# Altium schematic sheet I2CInterface.SchDoc: I2C Interface
size Letter; Organization: Midnight Sun Solar Rayce Car Team; Address1: University of Waterloo; Address2: 200 University Ave W; Address3: Waterloo, ON, Canada; Address4: N2L 3E9; SheetNumber: 4; SheetTotal: 4; Website: www.uwmidsun.com
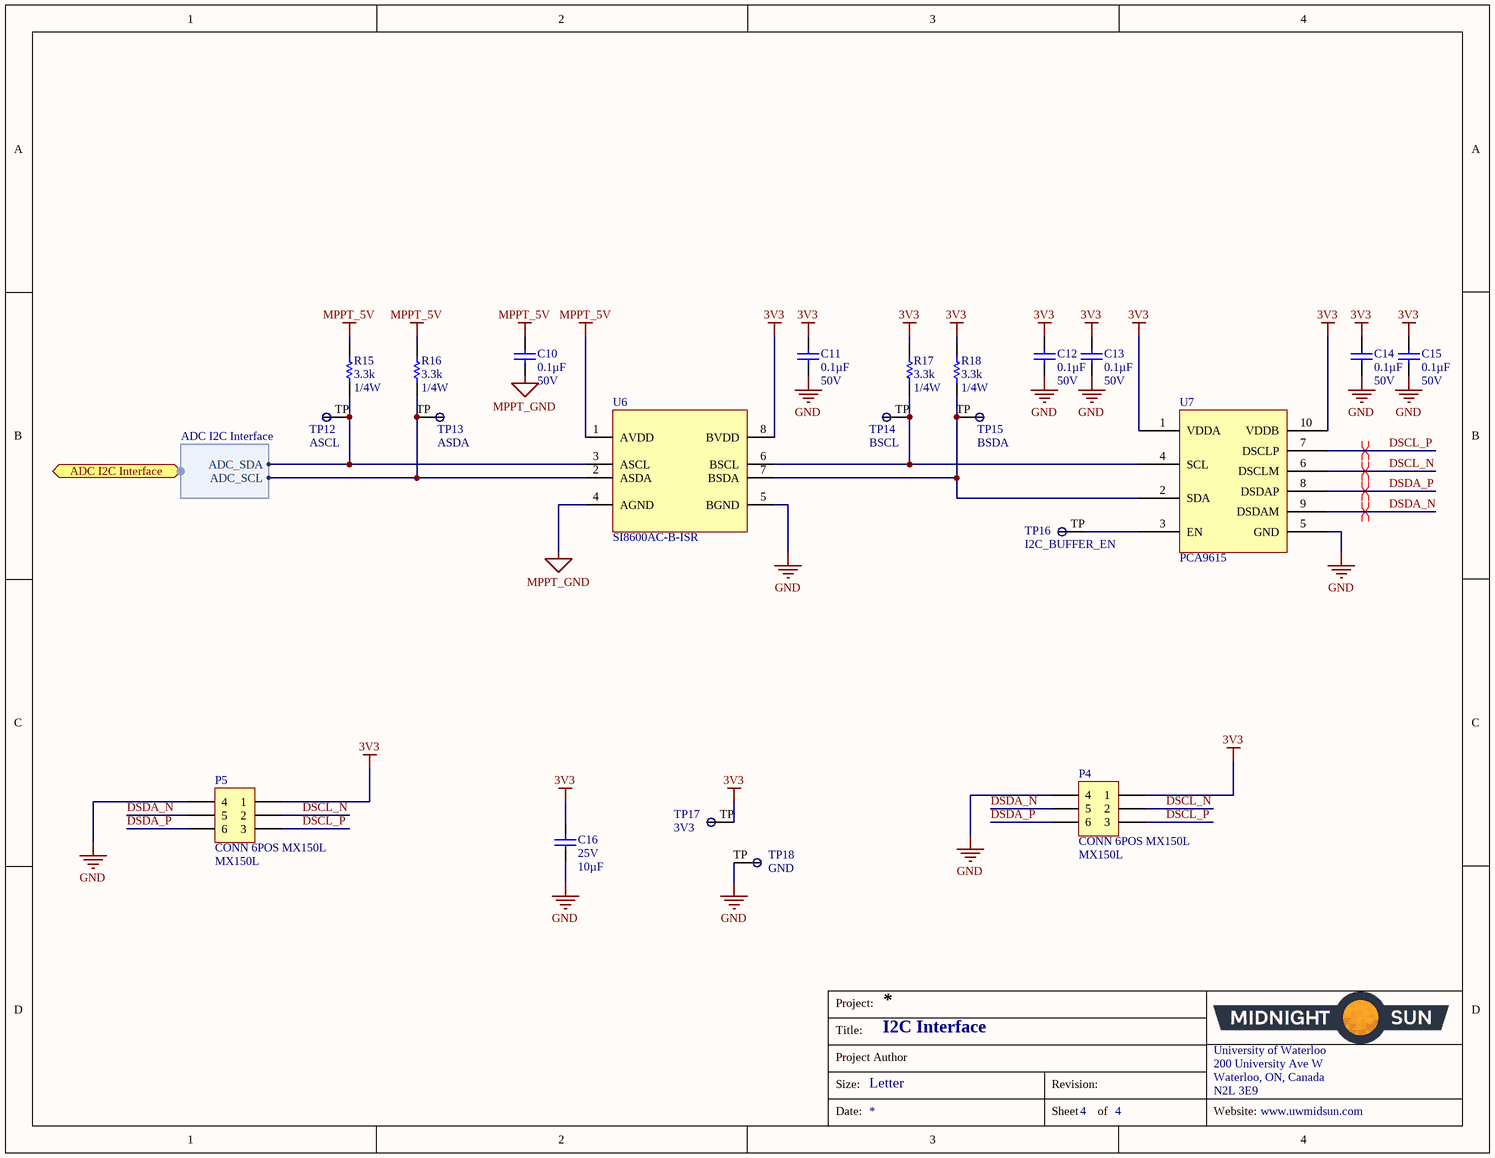
[diagram p0: I2CInterface.SchDoc]

## Parts
C10  Capacitance: 0.1µF  Voltage: 50V  [CAP, 0603]  (hidden comment: CAP CER 0.1UF 50V 10% X7R 0603)
C11  Capacitance: 0.1µF  Voltage: 50V  [CAP, 0603]  (hidden comment: CAP CER 0.1UF 50V 10% X7R 0603)
C12  Capacitance: 0.1µF  Voltage: 50V  [CAP, 0603]  (hidden comment: CAP CER 0.1UF 50V 10% X7R 0603)
C13  Capacitance: 0.1µF  Voltage: 50V  [CAP, 0603]  (hidden comment: CAP CER 0.1UF 50V 10% X7R 0603)
C14  Capacitance: 0.1µF  Voltage: 50V  [CAP, 0603]  (hidden comment: CAP CER 0.1UF 50V 10% X7R 0603)
C15  Capacitance: 0.1µF  Voltage: 50V  [CAP, 0603]  (hidden comment: CAP CER 0.1UF 50V 10% X7R 0603)
C16  Voltage - Rated: 25V  Capacitance: 10µF  [CAP, 0805]  (hidden comment: CAP CER 10uF 25V 10% X5R 0805)
P4  CONN 6POS MX150L  series: MX150L  [CONN, 6POS MX150L]
P5  CONN 6POS MX150L  series: MX150L  [CONN, 6POS MX150L]
R15  Resistance: 3.3k  Power: 1/4W  [RES, 0603]  (hidden comment: RES 3.3K OHM 1% 1/4W 0603)
R16  Resistance: 3.3k  Power: 1/4W  [RES, 0603]  (hidden comment: RES 3.3K OHM 1% 1/4W 0603)
R17  Resistance: 3.3k  Power: 1/4W  [RES, 0603]  (hidden comment: RES 3.3K OHM 1% 1/4W 0603)
R18  Resistance: 3.3k  Power: 1/4W  [RES, 0603]  (hidden comment: RES 3.3K OHM 1% 1/4W 0603)
TP12  ASCL  [Test Point]  (no BOM)
TP13  ASDA  [Test Point]  (no BOM)
TP14  BSCL  [Test Point]  (no BOM)
TP15  BSDA  [Test Point]  (no BOM)
TP16  I2C_BUFFER_EN  [Test Point]  (no BOM)
TP17  3V3  [Test Point]  (no BOM)
TP18  GND  [Test Point]  (no BOM)
U6  Manufacturer Part Number 1: SI8600AC-B-ISR  [IC DGTL ISO 3.75KV I2C 8SOIC NARROW BODY]  (hidden comment: IC DGTL ISO I2C 3.75KV 2CH 8SOIC)
U7  Base Part Number: PCA9615  [TSSOP50P490X110-10N]  (hidden comment: IC DIFFERENTIAL I2C BUFFER PCA9615)

## Ports
ADC I2C Interface (harness ADC I2C Interface)

## Harnesses
ADC I2C Interface: ADC_SCL, ADC_SDA

## Nets
3V3: C11.1 C12.1 C13.1 C14.1 C15.1 C16.1 P4.1 P5.1 R17.1 R18.1 TP17.TP U6.8(BVDD) U7.1(VDDA) U7.10(VDDB)
GND: C11.2 C12.2 C13.2 C14.2 C15.2 C16.2 P4.4 P5.4 TP18.TP U6.5(BGND) U7.5(GND)
MPPT_5V: C10.1 R15.1 R16.1 U6.1(AVDD)
MPPT_GND: C10.2 U6.4(AGND)
DSCL_N: P4.2 P5.2 U7.6(DSCLM)
DSCL_P: P4.3 P5.3 U7.7(DSCLP)
DSDA_N: P4.5 P5.5 U7.9(DSDAM)
DSDA_P: P4.6 P5.6 U7.8(DSDAP)
NetR15_2: R15.2 TP12.TP U6.3(ASCL) ; port ADC I2C Interface.ADC_SDA
NetR16_2: R16.2 TP13.TP U6.2(ASDA) ; port ADC I2C Interface.ADC_SCL
NetR17_2: R17.2 TP14.TP U6.6(BSCL) U7.4(SCL)
NetR18_2: R18.2 TP15.TP U6.7(BSDA) U7.2(SDA)
NetTP16_TP: TP16.TP U7.3(EN)

## Layout directives
differential pair: DSCL_N, DSCL_P, DSDA_N, DSDA_P

## Notes on the sheet
- Project:
- Title:
- Size:
- Project Author
- Letter
- Revision:
- University of Waterloo
- 200 University Ave W
- Waterloo, ON, Canada
- N2L 3E9
- Date:
- Sheet
- of
- Website:

## Library data of the parts
C10-C15 = CAP CER 0.1UF 50V 10% X7R 0603: 0.10µF ±10% 50V Ceramic Capacitor X7R 0603 (1608 Metric); Manufacturer 1: AVX Corporation; Manufacturer Part Number 1: 06035C104KAT2A; Supplier 1: Digi-Key; Supplier Part Number 1: 478-5052-1-ND; Packaging: Cut Tape (CT); Part Status: Active; Operating Temperature: -55°C ~ 125°C; Ratings: -; Mounting Type: Surface Mount, MLCC; Package / Case: 0603 (1608 Metric); Size / Dimension: 0.063" L x 0.032" W (1.60mm x 0.81mm); Height - Seated (Max): -; Thickness (Max): 0.035" (0.90mm); Lead Spacing: -; Lead Style: -; ComponentLink1URL: http://datasheets.avx.com/X7RDielectric.pdf; ComponentLink1Description: http://datasheets.avx.com/X7RDielectric.pdf; Tolerance: ±10%; Temperature Coefficient: X7R
C16 = CAP CER 10uF 25V 10% X5R 0805: 10µF ±10% 25V Ceramic Capacitor X5R 0805 (2012 Metric); Manufacturer: Murata Electronics North America; Manufacturer Part Number: GRM21BR61E106KA73L; Supplier 1: Digi-Key; RoHS: RoHS Compliant; Category: Capacitors; Stock 1: 1695157; Packaging: Cut Tape (CT); Part Status: Active; Tolerance: ±10%; Temperature Coefficient: X5R; Operating Temperature: -55°C ~ 85°C; Features: -; Ratings: -; Applications: General Purpose; Mounting Type: Surface Mount, MLCC; Package / Case: 0805 (2012 Metric); Size / Dimension: 0.079" L x 0.049" W (2.00mm x 1.25mm); Height - Seated (Max): -; Thickness (Max): 0.053" (1.35mm); Lead Spacing: -; Lead Style: -; ComponentLink1URL: http://search.murata.co.jp/Ceramy/image/img/A01X/G101/ENG/GRM21BR61E106KA73-01.pdf; ComponentLink1Description: http://search.murata.co.jp/Ceramy/image/img/A01X/G101/ENG/GRM21BR61E106KA73-01.pdf; Supplier Part Number 1: 490-5523-1-ND; Pricing 1: 1=0.3, 10=0.214, 100=0.1008, 500=0.07068, 1000=0.05851 (CAD)
P4 P5 = CONN 6POS MX150L: Connector Header Panel Mount, Through Hole, Right Angle 6 position 0.230" (5.84mm); Manufacturer: Molex; Manufacturer Part Number: 19427-0018; Number of Positions: 6; Connector Type: Male Pin; Current Rating: 18A; Gender: Male; Voltage Rating: 600V; Row Spacing: 0.23inch; Glow Wire Compliant: Non-compliant; Supplier 1: Digi-Key; Stock 1: 2808; Pricing 1: 1=6.02, 10=5.773, 100=4.769, 500=4.016, 1000=3.514 (USD); Mount: Through Hole,Panel; Housing Material: Polyester; Housing Colour: Black; Contact Plating: Nickel,Tin; Colour: Black; Contact Material: Copper Alloy; Min Operating Temperature: -40°C; Max Operating Temperature: 125°C; Number of Rows: 2; Packaging: Tray; Fastening Type: Ramp; Termination: Solder; Orientation: Right Angle; Package Quantity: 1; Number of Contacts: 6; Number of Circuits: 6; Pitch: 5.84mm; Radiation Hardening: No; Flammability Rating: UL94 V-0; ELV: Compliant; Lead Free: Lead Free; ComponentLink1URL: https://datasheet.ciiva.com/4554/0194270018-pcb-headers-135602-4554916.pdf; ComponentLink1Description: https://datasheet.ciiva.com/4554/0194270018-pcb-headers-135602-4554916.pdf; ComponentLink2URL: https://datasheet.ciiva.com/16725/0194270018-pcb-headers-16725700.pdf; ComponentLink2Description: https://datasheet.ciiva.com/16725/0194270018-pcb-headers-16725700.pdf; ComponentLink3URL: https://datasheet.ciiva.com/714/194270018-sd-714250.pdf; ComponentLink3Description: https://datasheet.ciiva.com/714/194270018-sd-714250.pdf; Supplier Part Number 1: WM17506-ND
R15-R18 = RES 3.3K OHM 1% 1/4W 0603: 3.3k Ohm ±1% 0.25W, 1/4W Chip Resistor 0603 (1608 Metric) Automotive AEC-Q200, Pulse Withstanding Thick Film; Manufacturer 1: Panasonic Electronic Components; Manufacturer Part Number 1: ERJ-PA3F3301V; Temperature Coefficient: ±100ppm/°C; Supplier 1: Digi-Key; Supplier Part Number 1: P3.3KBYCT-ND; Packaging: Cut Tape (CT); Part Status: Active; Composition: Thick Film; Operating Temperature: -55°C ~ 155°C; Package / Case: 0603 (1608 Metric); Supplier Device Package: 0603; Size / Dimension: 0.063" L x 0.031" W (1.60mm x 0.80mm); Height - Seated (Max): 0.022" (0.55mm); Failure Rate: -; ComponentLink1URL: https://industrial.panasonic.com/cdbs/www-data/pdf/RDO0000/AOA0000C291.pdf; ComponentLink1Description: https://industrial.panasonic.com/cdbs/www-data/pdf/RDO0000/AOA0000C291.pdf; Tolerance: ±1%
TP12-TP18 = Test Point
U6 = IC DGTL ISO I2C 3.75KV 2CH 8SOIC: I²C Digital Isolator 3750Vrms 2 Channel 35kV/µs CMTI 8-SOIC (0.154", 3.90mm Width); Manufacturer 1: Silicon Labs; Number of Channels: 2; Data Rate: 10Mbps; Propagation Delay: 26ns; Channel Type: Bidirectional; Isolated Power: No; Pulse Width Distortion (PWD): 32ns; Supplier 1: Digi-Key; Supplier Part Number 1: SI8600AC-B-ISRCT-ND; Stock 1: 4033; Pricing 1: 1=3.33, 25=3.2084, 100=3.0849 (USD); Case/Package: SOIC; Number of Pins: 8; Weight: 0.006596oz; Min Operating Temperature: -40°C; Max Operating Temperature: 125°C; Package Quantity: 2500; Packaging: Tape and Reel; Polarity: Bidirectional; ComponentLink1URL: https://datasheet.ciiva.com/14921/supportdocuments2ftechnicaldocs2fsi860x-14921653.pdf; ComponentLink1Description: https://datasheet.ciiva.com/14921/supportdocuments2ftechnicaldocs2fsi860x-14921653.pdf
U7 = IC DIFFERENTIAL I2C BUFFER PCA9615: Buffer, ReDriver 2 Channel 400kHz 10-TSSOP; Manufacturer: NXP USA Inc.; Manufacturer Part Number: PCA9615DPJ; Input: 2-Wire Bus; Number of Channels: 2; Voltage - Supply: 2.3 V ~ 5.5 V; Current - Supply: 16µA; Supplier 1: Digi-Key; RoHS: RoHS Compliant; Category: Integrated Circuits (ICs); Stock 1: 7673; Pricing 1: 1=4.38, 10=3.93, 100=3.2205, 500=2.74156, 1000=2.31216 (CAD); Packaging: Cut Tape (CT); Part Status: Active; Type: Buffer, ReDriver; Applications: I²C; Output: 2-Wire Bus; Data Rate (Max): 400kHz; Delay Time: -; Signal Conditioning: -; Operating Temperature: -40°C ~ 85°C; Package / Case: 10-TFSOP, 10-MSOP (0.118", 3.00mm Width); Supplier Device Package: 10-TSSOP; ComponentLink1URL: http://www.nxp.com/documents/data_sheet/PCA9615.pdf; ComponentLink1Description: http://www.nxp.com/documents/data_sheet/PCA9615.pdf; Supplier Part Number 1: 568-11484-1-ND